# Altium schematic sheet Control_Signal_Level_Shifters.SchDoc: Audio Research: Level Shifters
size A4; DrawnBy: Connor Dack; Engineer: Connor Dack; DocumentNumber: 4; Revision: 0.0; SheetNumber: 4; SheetTotal: 17
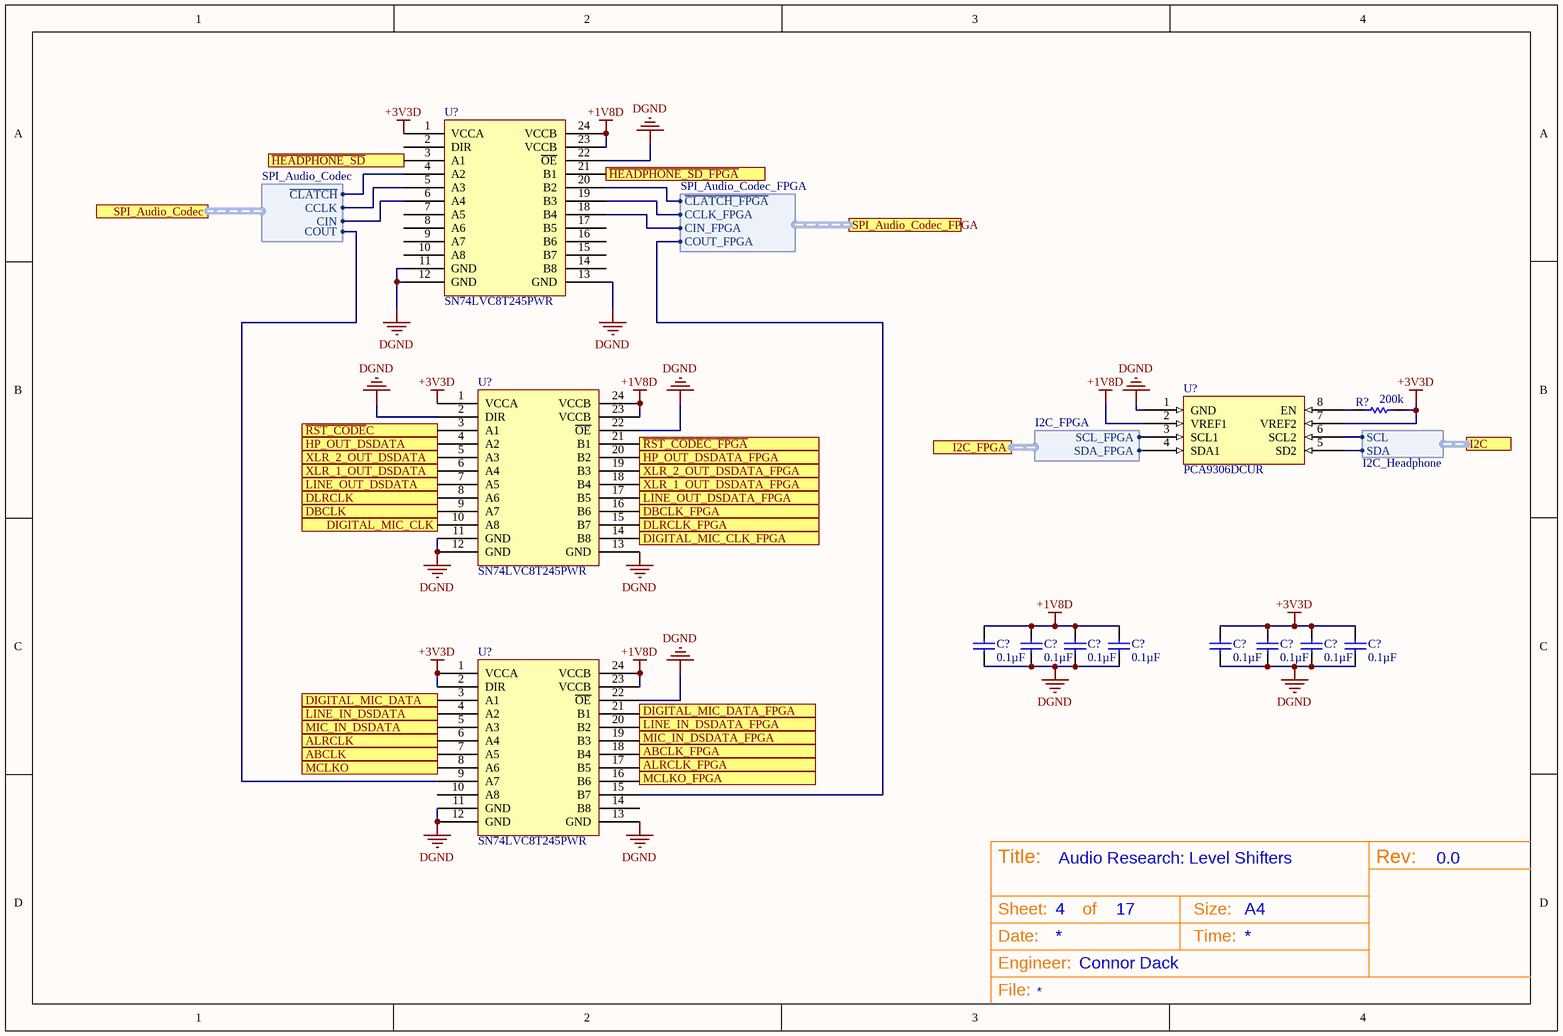
[diagram p0: Control_Signal_Level_Shifters.SchDoc]

## Parts
(Parts that share a designator on the sheet are numbered #1, #2 ... from top to bottom, then left to right.)
C?#1  Capacitance: 0.1µF  [3-0603_L]  (hidden comment: C1608X7R1H104K)
C?#2  Capacitance: 0.1µF  [3-0603_L]  (hidden comment: C1608X7R1H104K)
C?#3  Capacitance: 0.1µF  [3-0603_L]  (hidden comment: C1608X7R1H104K)
C?#4  Capacitance: 0.1µF  [3-0603_L]  (hidden comment: C1608X7R1H104K)
C?#5  Capacitance: 0.1µF  [3-0603_L]  (hidden comment: C1608X7R1H104K)
C?#6  Capacitance: 0.1µF  [3-0603_L]  (hidden comment: C1608X7R1H104K)
C?#7  Capacitance: 0.1µF  [3-0603_L]  (hidden comment: C1608X7R1H104K)
C?#8  Capacitance: 0.1µF  [3-0603_L]  (hidden comment: C1608X7R1H104K)
R?  Resistance (Ohms): 200k  [3-0603_R_L]  (hidden comment: ERJ-3EKF2003V)
U?#1  IC BUS TRANSCVR 8BIT 24TSSOP  [TSSOP40P640X120-24N]  (value not drawn)
U?#2  IC BUS TRANSCVR 8BIT 24TSSOP  [TSSOP40P640X120-24N]  (value not drawn)
U?#3  IC VOLT LEVEL TRANSLATOR US8  [TSOP65P400X130-8N]  (value not drawn)
U?#4  IC BUS TRANSCVR 8BIT 24TSSOP  [TSSOP40P640X120-24N]  (value not drawn)

## Ports
ABCLK (in), ABCLK_FPGA (out), ALRCLK (in), ALRCLK_FPGA (out), DBCLK (out), DBCLK_FPGA (in), DIGITAL_MIC_CLK (out), DIGITAL_MIC_CLK_FPGA (in), DIGITAL_MIC_DATA (in), DIGITAL_MIC_DATA_FPGA (out), DLRCLK (out), DLRCLK_FPGA (in), HP_OUT_DSDATA (out), HP_OUT_DSDATA_FPGA (in), I2C (harness I2C_Headphone), I2C_FPGA (harness I2C_FPGA), LINE_IN_DSDATA (in), LINE_IN_DSDATA_FPGA (out), LINE_OUT_DSDATA (out), LINE_OUT_DSDATA_FPGA (in), MCLKO (in), MCLKO_FPGA (out), MIC_IN_DSDATA (in), MIC_IN_DSDATA_FPGA (out), SPI_Audio_Codec (harness SPI_Audio_Codec), SPI_Audio_Codec_FPGA (harness SPI_Audio_Codec_FPGA), XLR_1_OUT_DSDATA (out), XLR_1_OUT_DSDATA_FPGA (in), XLR_2_OUT_DSDATA (out), XLR_2_OUT_DSDATA_FPGA (in), ~{HEADPHONE_SD_FPGA} (in), ~{HEADPHONE_SD} (out), ~{RST_CODEC_FPGA} (in), ~{RST_CODE}C (out)

## Harnesses
I2C_Headphone: SDA, SCL
I2C_FPGA: SDA_FPGA, SCL_FPGA
SPI_Audio_Codec: CIN, COUT, CCLK, ~{CLATCH}
SPI_Audio_Codec_FPGA: CIN_FPGA, COUT_FPGA, CCLK_FPGA, ~{CLATCH_FPGA}

## Nets
+1V8D: C?#1.2 C?#2.2 C?#3.2 C?#4.2 U?#1.23(VCCB) U?#1.24(VCCB) U?#2.23(VCCB) U?#2.24(VCCB) U?#3.2(VREF1) U?#4.23(VCCB) U?#4.24(VCCB)
+3V3D: C?#5.2 C?#6.2 C?#7.2 C?#8.2 R?.2 U?#1.1(VCCA) U?#2.1(VCCA) U?#3.7(VREF2) U?#4.1(VCCA) U?#4.2(DIR)
DGND: C?#1.1 C?#2.1 C?#3.1 C?#4.1 C?#5.1 C?#6.1 C?#7.1 C?#8.1 U?#1.11(GND) U?#1.12(GND) U?#1.13(GND) U?#1.22(~{OE}) U?#2.2(DIR) U?#2.11(GND) U?#2.12(GND) U?#2.13(GND) U?#2.22(~{OE}) U?#3.1(GND) U?#4.11(GND) U?#4.12(GND) U?#4.13(GND) U?#4.22(~{OE})
~{RST_CODE}C: U?#2.3(A1) ; port ~{RST_CODE}C
~{RST_CODEC_FPGA}: U?#2.21(B1) ; port ~{RST_CODEC_FPGA}
ABCLK: U?#4.7(A5) ; port ABCLK
ALRCLK: U?#4.6(A4) ; port ALRCLK
DBCLK: U?#2.9(A7) ; port DBCLK
DBCLK_FPGA: U?#2.16(B6) ; port DBCLK_FPGA
DIGITAL_MIC_CLK: U?#2.10(A8) ; port DIGITAL_MIC_CLK
DIGITAL_MIC_CLK_FPGA: U?#2.14(B8) ; port DIGITAL_MIC_CLK_FPGA
DIGITAL_MIC_DATA: U?#4.3(A1) ; port DIGITAL_MIC_DATA
DLRCLK: U?#2.8(A6) ; port DLRCLK
DLRCLK_FPGA: U?#2.15(B7) ; port DLRCLK_FPGA
~{HEADPHONE_SD}: U?#1.3(A1) ; port ~{HEADPHONE_SD}
~{HEADPHONE_SD_FPGA}: U?#1.21(B1) ; port ~{HEADPHONE_SD_FPGA}
HP_OUT_DSDATA: U?#2.4(A2) ; port HP_OUT_DSDATA
HP_OUT_DSDATA_FPGA: U?#2.20(B2) ; port HP_OUT_DSDATA_FPGA
LINE_IN_DSDATA: U?#4.4(A2) ; port LINE_IN_DSDATA
LINE_OUT_DSDATA: U?#2.7(A5) ; port LINE_OUT_DSDATA
LINE_OUT_DSDATA_FPGA: U?#2.17(B5) ; port LINE_OUT_DSDATA_FPGA
MCLKO: U?#4.8(A6) ; port MCLKO
MIC_IN_DSDATA: U?#4.5(A3) ; port MIC_IN_DSDATA
XLR_1_OUT_DSDATA: U?#2.6(A4) ; port XLR_1_OUT_DSDATA
XLR_1_OUT_DSDATA_FPGA: U?#2.18(B4) ; port XLR_1_OUT_DSDATA_FPGA
XLR_2_OUT_DSDATA: U?#2.5(A3) ; port XLR_2_OUT_DSDATA
XLR_2_OUT_DSDATA_FPGA: U?#2.19(B3) ; port XLR_2_OUT_DSDATA_FPGA
NetR?_1: R?.1 U?#3.8(EN)
NetU?#1_4: U?#1.4(A2) ; port SPI_Audio_Codec.~{CLATCH}
NetU?#1_5: U?#1.5(A3) ; port SPI_Audio_Codec.CCLK
NetU?#1_6: U?#1.6(A4) ; port SPI_Audio_Codec.CIN
NetU?#1_18: U?#1.18(B4) ; port SPI_Audio_Codec_FPGA.CIN_FPGA
NetU?#1_19: U?#1.19(B3) ; port SPI_Audio_Codec_FPGA.CCLK_FPGA
NetU?#1_20: U?#1.20(B2) ; port SPI_Audio_Codec_FPGA.~{CLATCH_FPGA}
NetU?#3_3: U?#3.3(SCL1) ; port I2C_FPGA.SCL_FPGA
NetU?#3_4: U?#3.4(SDA1) ; port I2C_FPGA.SDA_FPGA
NetU?#3_5: U?#3.5(SD2) ; port I2C.SDA
NetU?#3_6: U?#3.6(SCL2) ; port I2C.SCL
NetU?#4_9: U?#4.9(A7) ; port SPI_Audio_Codec.COUT
NetU?#4_15: U?#4.15(B7) ; port SPI_Audio_Codec_FPGA.COUT_FPGA

Not connected (* = marked no-connect by the designer): U?#1 2(DIR) 7(A5) 8(A6) 9(A7) 10(A8) 14(B8) 15(B7) 16(B6) 17(B5); U?#4 10(A8) 14(B8) 16(B6) 17(B5) 18(B4) 19(B3) 20(B2) 21(B1)

## Notes on the sheet
- Title:
- Sheet:
- of
- Size:
- A4
- Rev:
- Date:
- Engineer:
- Time:
- File:

## Library data of the parts
C?#1-C?#8 = C1608X7R1H104K: CAP CER 0.1UF 50V 10% X7R 0603; Manufacturer: TDK Corporation; Supplier 1: Digi-Key; Manufacturer Part Number: C1608X7R1H104K; RoHS: RoHS Compliant; Category: Capacitors; Stock 1: 2442296; Pricing 1: 10=0.048, 100=0.022, 250=0.018, 500=0.0154, 1000=0.012 (USD); Voltage - Rated: 50V; Tolerance: ±10%; Temperature Coefficient: X7R; Mounting Type: Surface Mount, MLCC; Operating Temperature: -55°C ~ 125°C; Applications: General Purpose; Ratings: -; Package / Case: 0603 (1608 Metric); Size / Dimension: 0.063" L x 0.031" W (1.60mm x 0.80mm); Height - Seated (Max): -; Thickness (Max): 0.037" (0.95mm); Lead Spacing: -; Features: -; Packaging: Cut Tape (CT); Lead Style: -; ComponentLink1URL: http://www.tdk.com/pdf/general_B11.pdf; ComponentLink1Description: http://www.tdk.com/pdf/general_B11.pdf; Supplier Part Number 1: 445-1314-1-ND
R? = ERJ-3EKF2003V: RES SMD 200K OHM 1% 1/10W 0603; Manufacturer: Panasonic Electronic Components; Power (Watts): 0.1W, 1/10W; Temperature Coefficient: ±100ppm/°C; Supplier 1: Digi-Key; Manufacturer Part Number: ERJ-3EKF2003V; RoHS: RoHS Compliant; Category: Resistors; Stock 1: 163414; Pricing 1: 1=0.1, 10=0.019, 25=0.014, 50=0.0108, 100=0.0079, 250=0.00604, 500=0.00482, 1000=0.00355 (USD); Packaging: Cut Tape (CT); Part Status: Active; Tolerance: ±1%; Composition: Thick Film; Features: Automotive AEC-Q200; Operating Temperature: -55°C ~ 155°C; Package / Case: 0603 (1608 Metric); Supplier Device Package: 0603; Size / Dimension: 0.063" L x 0.031" W (1.60mm x 0.80mm); Height - Seated (Max): 0.022" (0.55mm); Failure Rate: -; ComponentLink1URL: https://industrial.panasonic.com/cdbs/www-data/pdf/RDA0000/AOA0000C283.pdf; ComponentLink1Description: https://industrial.panasonic.com/cdbs/www-data/pdf/RDA0000/AOA0000C283.pdf; Supplier Part Number 1: P200KHCT-ND
U?#1 U?#2 U?#4 = SN74LVC8T245PWR: Voltage Level Translator Bidirectional 1 Circuit 8 Channel 24-TSSOP; Manufacturer: Texas Instruments; Number of Channels: 8; Propagation Delay: 4.2ns; Number of Elements: 1; Min Supply Voltage: 1.65V; Max Supply Voltage: 5.5V; Operating Supply Voltage: 3.3V; Data Rate: 500Mbps; Logic Function: Transceiver,Translator; High Level Output Current: -32mA; Low Level Output Current: 32mA; Polarity: Non-Inverting; Turn-On Delay Time: 32.2ns; Quiescent Current: 15uA; ComponentLink1URL: https://datasheet.ciiva.com/1899/sn74lvc8t245-1899395.pdf; ComponentLink1Description: https://datasheet.ciiva.com/1899/sn74lvc8t245-1899395.pdf; ComponentLink2URL: https://datasheet.ciiva.com/34301/1048559-34301923.pdf; ComponentLink2Description: https://datasheet.ciiva.com/34301/1048559-34301923.pdf; ComponentLink3URL: https://datasheet.ciiva.com/1899/sn74lvc8t245-1899396.pdf; ComponentLink3Description: https://datasheet.ciiva.com/1899/sn74lvc8t245-1899396.pdf; ComponentLink4URL: https://datasheet.ciiva.com/1899/sn74lvc8t245-1899397.pdf; ComponentLink4Description: https://datasheet.ciiva.com/1899/sn74lvc8t245-1899397.pdf; ComponentLink5URL: https://datasheet.ciiva.com/7795/1763937-7795013.pdf; ComponentLink5Description: https://datasheet.ciiva.com/7795/1763937-7795013.pdf; ComponentLink6URL: https://datasheet.ciiva.com/15086/getdatasheetpartid-48801-15086005.pdf; ComponentLink6Description: https://datasheet.ciiva.com/15086/getdatasheetpartid-48801-15086005.pdf; ComponentLink7URL: https://datasheet.ciiva.com/25973/sn74lvc8t245-25973803.pdf; ComponentLink7Description: https://datasheet.ciiva.com/25973/sn74lvc8t245-25973803.pdf; ComponentLink8URL: https://datasheet.ciiva.com/46439/1831204-46439647.pdf; ComponentLink8Description: https://datasheet.ciiva.com/46439/1831204-46439647.pdf; ComponentLink9URL: https://datasheet.ciiva.com/26867/sn74lvc8t245pwr-26867745.pdf; ComponentLink9Description: https://datasheet.ciiva.com/26867/sn74lvc8t245pwr-26867745.pdf; ComponentLink10URL: https://datasheet.ciiva.com/41455/001017232-da-01-en-ic-bus-8bit-sn74lvc8t245pwr-tssop-24-tid-41455868.pdf; ComponentLink10Description: https://datasheet.ciiva.com/41455/001017232-da-01-en-ic-bus-8bit-sn74lvc8t245pwr-tssop-24-tid-41455868.pdf; Supplier 1: Digi-Key; Stock 1: 119243; Pricing 1: 1=1.05, 10=0.936, 100=0.7297, 500=0.6028, 1000=0.4759 (USD); Mount: Surface Mount; Case/Package: TSSOP; Number of Pins: 24; Weight: 0.003157oz; Contact Plating: Gold; Min Operating Temperature: -40°C; Max Operating Temperature: 85°C; Package Quantity: 1; Packaging: Tape and Reel; Direction: Bidirectional; Number of Bits: 8; Number of Outputs: 8; Length: 7.9mm; Height: 1.05mm; Width: 4.5mm; Radiation Hardening: No; REACH SVHC: No SVHC; Lead Free: Lead Free; Supplier Part Number 1: 296-18593-6-ND; Manufacturer Part Number: SN74LVC8T245PWR
U?#3 = PCA9306DCUR: Voltage Level Translator Bidirectional 1 Circuit 2 Channel US8; Manufacturer: Texas Instruments; Number of Inputs: 2; Output Current: 64mA; Propagation Delay: 1.4ns; Min Supply Voltage: 0uV; Max Supply Voltage: 5V; Turn-On Delay Time: 1.2ns; Output Type: I2C; Supplier 1: Digi-Key; Stock 1: 22861; Pricing 1: 1=0.68, 10=0.598, 100=0.4586, 500=0.3626, 1000=0.2901 (USD); Case/Package: VSSOP; Number of Pins: 8; Weight: 0.000339oz; Contact Plating: Gold; Min Operating Temperature: -40°C; Max Operating Temperature: 85°C; Packaging: Tape and Reel; Package Quantity: 1; Number of Channels: 2; Number of Outputs: 2; Logic Function: Translator; Number of Bits: 2; Termination: SMD/SMT; Length: 2.3mm; Height: 0.85mm; Width: 2mm; Radiation Hardening: No; REACH SVHC: No SVHC; Lead Free: Lead Free; ComponentLink1URL: https://datasheet.ciiva.com/1899/pca9306-1899329.pdf; ComponentLink1Description: https://datasheet.ciiva.com/1899/pca9306-1899329.pdf; ComponentLink2URL: https://datasheet.ciiva.com/1899/pca9306-1899330.pdf; ComponentLink2Description: https://datasheet.ciiva.com/1899/pca9306-1899330.pdf; ComponentLink3URL: https://datasheet.ciiva.com/1899/pca9306-1899331.pdf; ComponentLink3Description: https://datasheet.ciiva.com/1899/pca9306-1899331.pdf; ComponentLink4URL: https://datasheet.ciiva.com/14287/pca9306-14287462.pdf; ComponentLink4Description: https://datasheet.ciiva.com/14287/pca9306-14287462.pdf; ComponentLink5URL: https://datasheet.ciiva.com/30509/pca9306dcur-30509814.pdf; ComponentLink5Description: https://datasheet.ciiva.com/30509/pca9306dcur-30509814.pdf; ComponentLink6URL: https://datasheet.ciiva.com/36526/2030035-36526265.pdf; ComponentLink6Description: https://datasheet.ciiva.com/36526/2030035-36526265.pdf; ComponentLink7URL: https://datasheet.ciiva.com/1508/1815321-1508635.pdf; ComponentLink7Description: https://datasheet.ciiva.com/1508/1815321-1508635.pdf; ComponentLink8URL: https://datasheet.ciiva.com/1508/1862428-1508795.pdf; ComponentLink8Description: https://datasheet.ciiva.com/1508/1862428-1508795.pdf; Supplier Part Number 1: 296-17988-6-ND; Manufacturer Part Number: PCA9306DCUR